# Altium schematic sheet MCU.SchDoc
size 420 x 297 mm
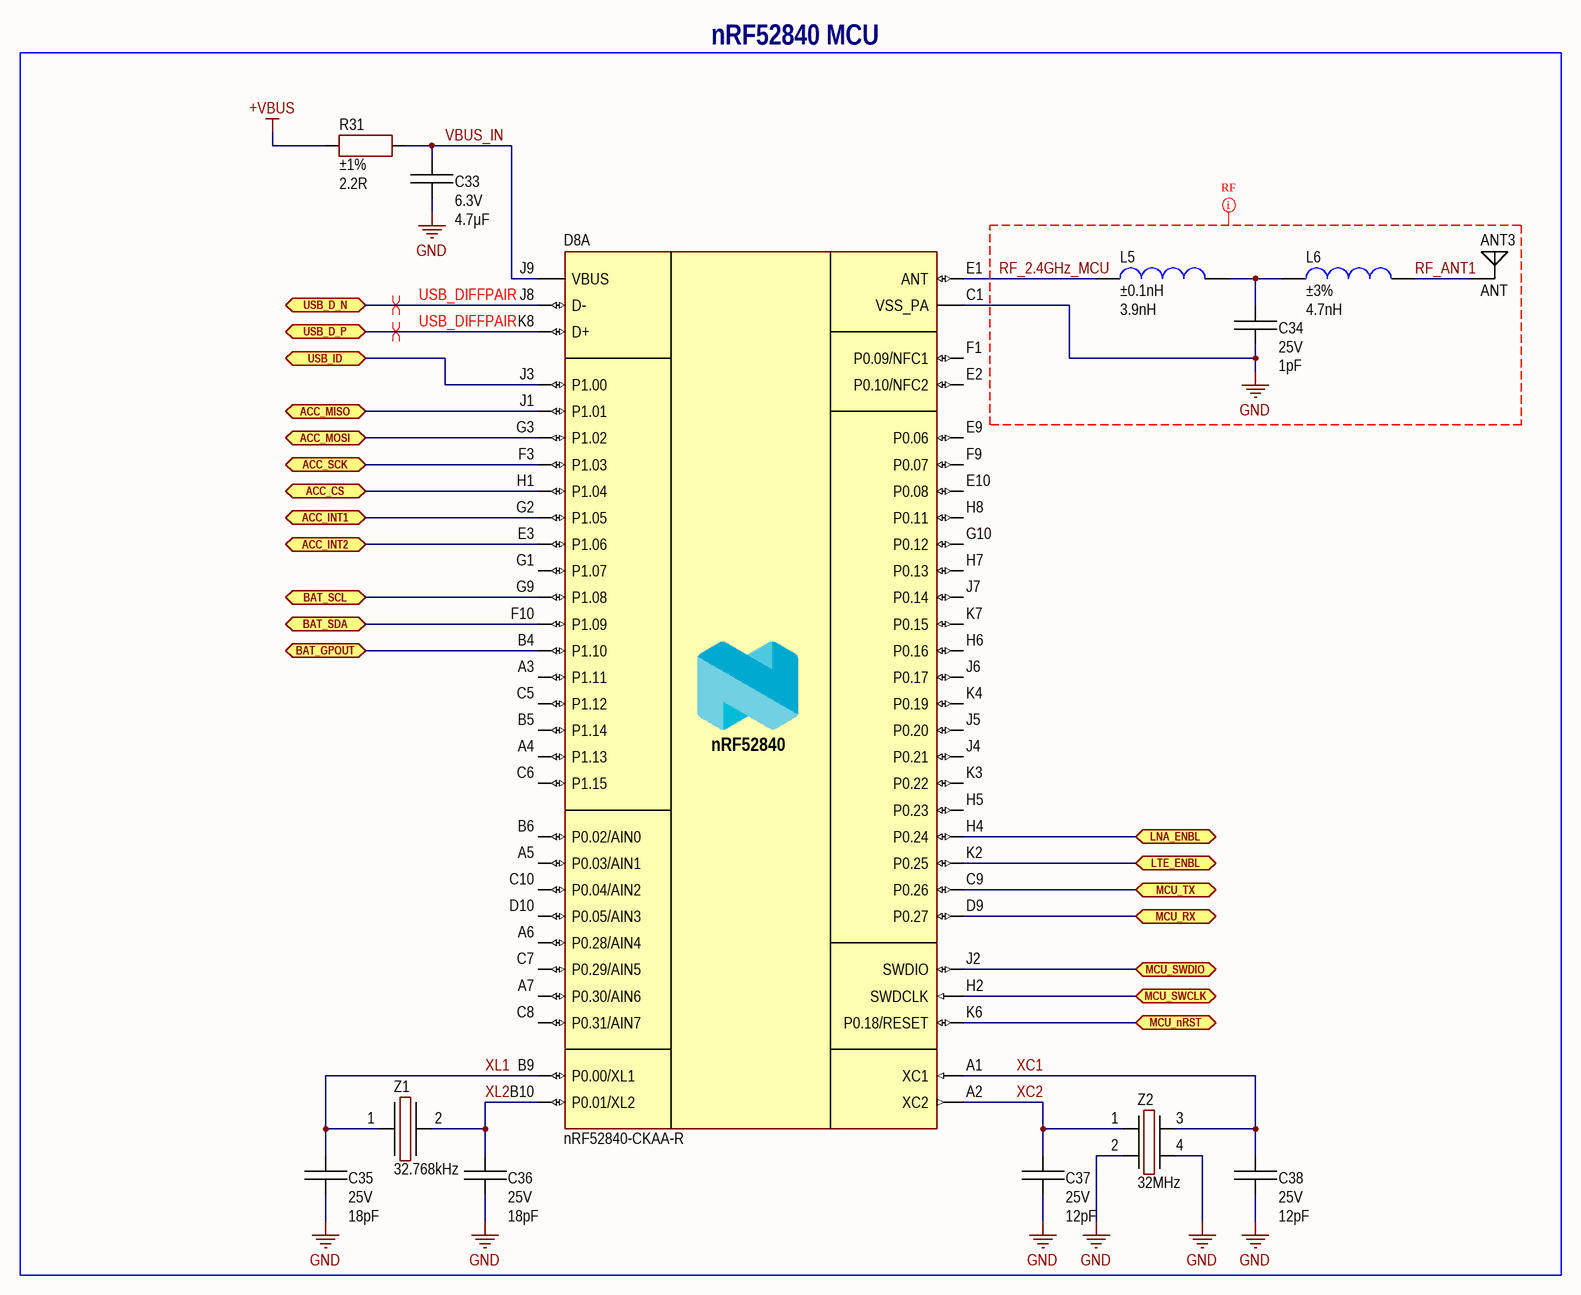
[diagram p0: MCU.SchDoc]

## Parts
ANT3  CommentText: ANT  [ANT: ANT2012LL00R2400A]
C33  value 4.7μF  Voltage: 6.3V  [CAP: 0603_NO_SILK]
C34  value 1pF  Voltage: 25V  [CAP: 0201]
C35  value 18pF  Voltage: 25V  [CAP: 0201]
C36  value 18pF  Voltage: 25V  [CAP: 0201]
C37  value 12pF  Voltage: 25V  [CAP: 0201]
C38  value 12pF  Voltage: 25V  [CAP: 0201]
D8  PartNumber: nRF52840-CKAA-R  [MCU: nRF52840_WLCP93]  (part A of 2)
L5  value 3.9nH  Tolerance: ±0.1nH  [IND: 0201]
L6  value 4.7nH  Tolerance: ±3%  [IND: 0201]
R31  value 2.2R  Tolerance: ±1%  [RES: 0402]
Z1  Frequency: 32.768kHz  [OSC: 2012]
Z2  Frequency: 32MHz  [OSC: 2016]

## Blocks framed on the sheet
nRF52840 MCU: ANT3 C33-C38 D8 L5 L6 R31 Z1 Z2

## Ports
ACC_CS (bidir), ACC_INT1 (bidir), ACC_INT2 (bidir), ACC_MISO (bidir), ACC_MOSI (bidir), ACC_SCK (bidir), BAT_GPOUT (bidir), BAT_SCL (bidir), BAT_SDA (bidir), LNA_ENBL (bidir), LTE_ENBL (bidir), MCU_nRST (bidir), MCU_RX (bidir), MCU_SWCLK (bidir), MCU_SWDIO (bidir), MCU_TX (bidir), USB_D_N (bidir), USB_D_P (bidir), USB_ID (bidir)

## Nets
+VBUS: R31.1
GND: C33.1 C34.1 C35.1 C36.1 C37.1 C38.1 D8.C1(VSS_PA) Z2.2 Z2.4
ACC_CS: D8.H1(P1.04) ; port ACC_CS
ACC_INT1: D8.G2(P1.05) ; port ACC_INT1
ACC_INT2: D8.E3(P1.06) ; port ACC_INT2
ACC_MISO: D8.J1(P1.01) ; port ACC_MISO
ACC_MOSI: D8.G3(P1.02) ; port ACC_MOSI
ACC_SCK: D8.F3(P1.03) ; port ACC_SCK
BAT_GPOUT: D8.B4(P1.10) ; port BAT_GPOUT
BAT_SCL: D8.G9(P1.08) ; port BAT_SCL
BAT_SDA: D8.F10(P1.09) ; port BAT_SDA
LNA_ENBL: D8.H4(P0.24) ; port LNA_ENBL
LTE_ENBL: D8.K2(P0.25) ; port LTE_ENBL
MCU_nRST: D8.K6(P0.18/RESET) ; port MCU_nRST
MCU_RX: D8.D9(P0.27) ; port MCU_RX
MCU_SWCLK: D8.H2(SWDCLK) ; port MCU_SWCLK
MCU_SWDIO: D8.J2(SWDIO) ; port MCU_SWDIO
MCU_TX: D8.C9(P0.26) ; port MCU_TX
RF_2.4GHz_MCU: D8.E1(ANT) L5.2
RF_ANT1: ANT3.1 L6.1
USB_D_N: D8.J8(D-) ; port USB_D_N
USB_D_P: D8.K8(D+) ; port USB_D_P
USB_ID: D8.J3(P1.00) ; port USB_ID
VBUS_IN: C33.2 D8.J9(VBUS) R31.2
XC1: C38.2 D8.A1(XC1) Z2.3
XC2: C37.2 D8.A2(XC2) Z2.1
XL1: C35.2 D8.B9(P0.00/XL1) Z1.1
XL2: C36.2 D8.B10(P0.01/XL2) Z1.2
NetC34_2: C34.2 L5.1 L6.2

Not connected (* = marked no-connect by the designer): D8 A3(P1.11) A4(P1.13) A5(P0.03/AIN1) A6(P0.28/AIN4) A7(P0.30/AIN6) B5(P1.14) B6(P0.02/AIN0) C5(P1.12) C6(P1.15) C7(P0.29/AIN5) C8(P0.31/AIN7) C10(P0.04/AIN2) D10(P0.05/AIN3) E2(P0.10/NFC2) E9(P0.06) E10(P0.08) F1(P0.09/NFC1) F9(P0.07) G1(P1.07) G10(P0.12) H5(P0.23) H6(P0.16) H7(P0.13) H8(P0.11) J4(P0.21) J5(P0.20) J6(P0.17) J7(P0.14) K3(P0.22) K4(P0.19) K7(P0.15)

## Layout directives
net class RF: GND, RF_2.4GHz_MCU, RF_ANT1
differential pair; differential pair class USB_DIFFPAIR: USB_D_N, USB_D_P

## Notes on the sheet
- Author
- Manufacturer
- Date
- Page
- Total pages
- Size page
- A3
- Materials

## Library data of the parts
ANT3 = ANT2012LL00R2400A: 2.45GHz Bluetooth, ISM, Wi-Fi, Zigbee Chip RF Antenna 2.4GHz ~ 2.5GHz 3.77dBi Solder Surface Mount; Manufacturer: Yageo; ValueManufacturerPartNumber: Ceramic antenna, 2x1.25mm; HelpURL: https://www.digikey.com/en/products/detail/yageo/ANT2012LL00R2400A/9360375; Type: Ceramic antenna; PartNumber: ANT2012LL00R2400A; Package: 2x1.25mm
C33 = Ceramic_0603: 4.7 µF ±20% 6.3V Ceramic Capacitor X7R 0603 (1608 Metric); Manufacturer: Yageo; PartNumber: CC0603MRX7R5BB475; ValueManufacturerPartNumber: Ceramic capacitor, 4.7μF, X7R, ±10%, 6.3V, 0603, -55...+125°C; Tolerance: ±10%; Package: 0603; HelpURL: https://www.digikey.com/en/products/detail/yageo/CC0603MRX7R5BB475/7164380; Temperature: -55...+125°C; TypeCapacitor: Ceramic capacitor; TypeDielectric: X7R
C34 = Ceramic_0201: 1 pF ±0.05pF 25V Ceramic Capacitor C0G, NP0 0201 (0603 Metric); Manufacturer: Murata Electronics; PartNumber: GJM0335C1E1R0WB01D; ValueManufacturerPartNumber: Ceramic capacitor, 1pF, NP0, ±0.05pF, 25V, 0201, -55...+125°C; Package: 0201; HelpURL: https://www.digikey.com/en/products/detail/murata-electronics/GJM0335C1E1R0WB01D/2592505; Temperature: -55...+125°C; TypeCapacitor: Ceramic capacitor; Tolerance: ±0.05pF; TypeDielectric: NP0
C35 C36 = Ceramic_0201: 18 pF ±5% 25V Ceramic Capacitor C0G, NP0 0201 (0603 Metric); Manufacturer: Yageo; PartNumber: CC0201JRNPO8BN180; ValueManufacturerPartNumber: Ceramic capacitor, 18pF, NP0, ±10%, 25V, 0201, -55...+125°C; Tolerance: ±10%; Package: 0201; HelpURL: https://www.digikey.com/en/products/detail/yageo/CC0201JRNPO8BN180/5883131; Temperature: -55...+125°C; TypeCapacitor: Ceramic capacitor; TypeDielectric: NP0
C37 C38 = Ceramic_0201: 12 pF ±5% 25V Ceramic Capacitor C0G, NP0 0201 (0603 Metric); Manufacturer: Yageo; PartNumber: CC0201JRNPO8BN120; ValueManufacturerPartNumber: Ceramic capacitor, 12pF, NP0, ±10%, 25V, 0201, -55...+125°C; Tolerance: ±10%; Package: 0201; HelpURL: https://www.digikey.com/en/products/detail/yageo/CC0201JRNPO8BN120/2833559; Temperature: -55...+125°C; TypeCapacitor: Ceramic capacitor; TypeDielectric: NP0
D8 = nRF52840: MCU; Manufacturer: Nordic Semiconductor; CoreSize: 32bit; Speed: 64 MHz; MemoryROM: 1 MB; CoreProcessor: Cortex-M4; MemoryRAM: 256 kB; HelpURL: https://www.mouser.com/ProductDetail/Nordic-Semiconductor/nRF52840-CKAA-R?qs=PqoDHHvF64%2FDLCQsJ11t5w%3D%3D; ComponentType: IC microcontroller; Package: 93-WLCSP; ValueManufacturerPartNumber: =ComponentType+', '+CoreSize+', '+CoreProcessor+', '+Speed+', '+MemoryROM+', '+MemoryRAM+', '+Supply+', '+Temperature+', '+Package
L5 = Inductor_0201: 3.9 nH Unshielded Thick Film Inductor 400 mA 300mOhm Max 0201 (0603 Metric); Manufacturer: Murata Electronics; PartNumber: LQP03TN3N9B02D; ValueManufacturerPartNumber: Fixed inductor, 3.9nH, ±0.1nH, 0201, 400mA, -55...+125°C; TypeInductor: Fixed inductor; MaxCurrent: 400mA; Package: 0201; HelpURL: https://www.digikey.com/en/products/detail/murata-electronics/LQP03TN3N9B02D/2391748; Temperature: -55...+125°C
L6 = Inductor_0201: 4.7 nH Unshielded Thick Film Inductor 350 mA 400mOhm Max 0201 (0603 Metric); Manufacturer: Murata Electronics; PartNumber: LQP03TN4N7H02D; ValueManufacturerPartNumber: Fixed inductor, 4.7nH, ±3%, 0201, 350mA, -55...+125°C; TypeInductor: Fixed inductor; MaxCurrent: 350mA; Package: 0201; HelpURL: https://www.digikey.com/en/products/detail/murata-electronics/LQP03TN4N7H02D/4358101; Temperature: -55...+125°C
R31 = Resistor_0402: Manufacturer: Yageo; PartNumber: RC0402FR-072R2L; ValueManufacturerPartNumber: Resistor film, 2.2R, ±1%, 0402, 0.063W, -55...+125°C; TypeResistor: Resistor film; Power: 0.063W; Package: 0402; HelpURL: https://www.digikey.com/en/products/detail/yageo/RC0402FR-072R2L/1037048; Temperature: -55...+125°C
Z1 = Crystal_2012: Crystal; Manufacturer: Abracon; PartNumber: ABS06-32.768KHZ-1-T; ValueManufacturerPartNumber: Crystal, 32.768kHz, 12.5pF, ±20ppm, case 2012, -40...+85°C; LoadCapacitance: 12.5pF; Tolerance: ±20ppm; Package: case 2012; HelpURL: https://www.digikey.com/en/products/detail/abracon-llc/ABS06-32-768KHZ-1-T/2217994; Temperature: -40...+85°C; TypeOscilator: Crystal
Z2 = Crystal_2016: 32 MHz ±10ppm Crystal 8pF 60 Ohms 4-SMD, No Lead; Manufacturer: EPSON; PartNumber: FA-128 32.0000MF10Z-AJ3; ValueManufacturerPartNumber: Crystal, 32MHz, 8pF, ±50ppm, case 2016, -30...+85°C; Tolerance: ±50ppm; Package: case 2016; HelpURL: https://www.digikey.com/en/products/detail/epson/FA-128-32-0000MF10Z-AJ3/5259651; Temperature: -30...+85°C; TypeOscilator: Crystal; LoadCapacitance: 8pF